# EAGLE design Yukari4 Naninator (EAGLE 7.6.0)
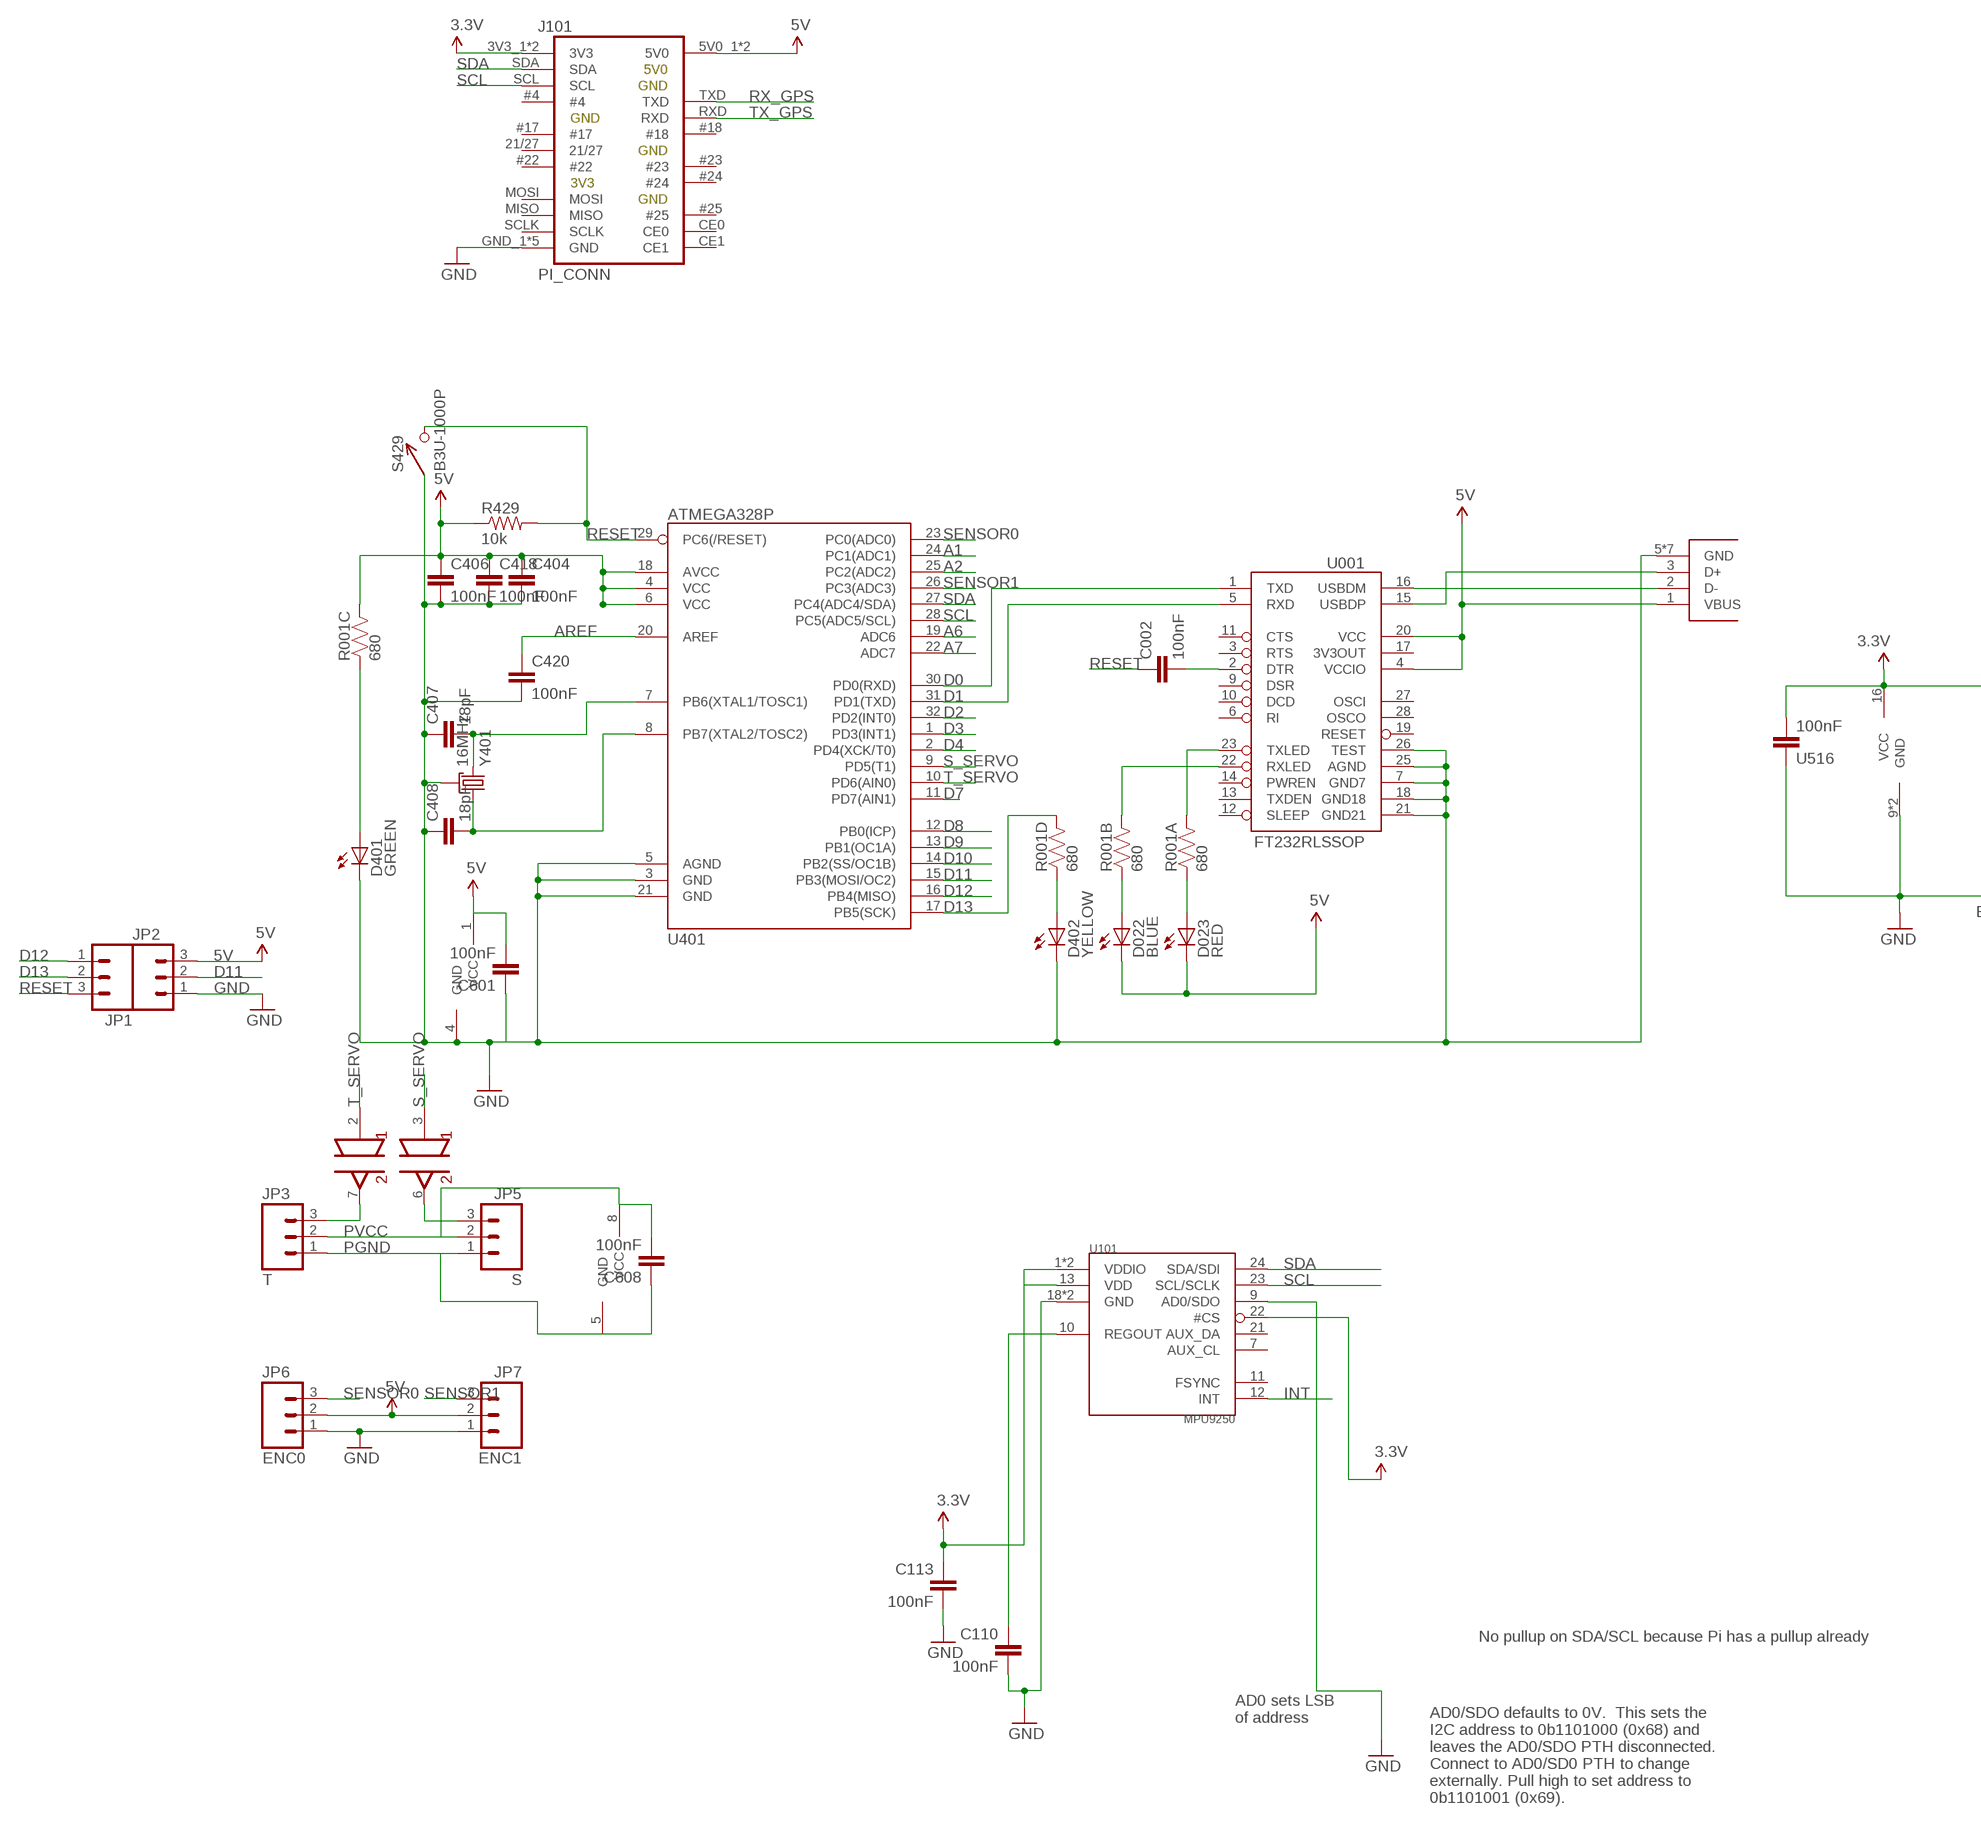
[diagram p0: schematic, sheet 1, part 1 of 2]
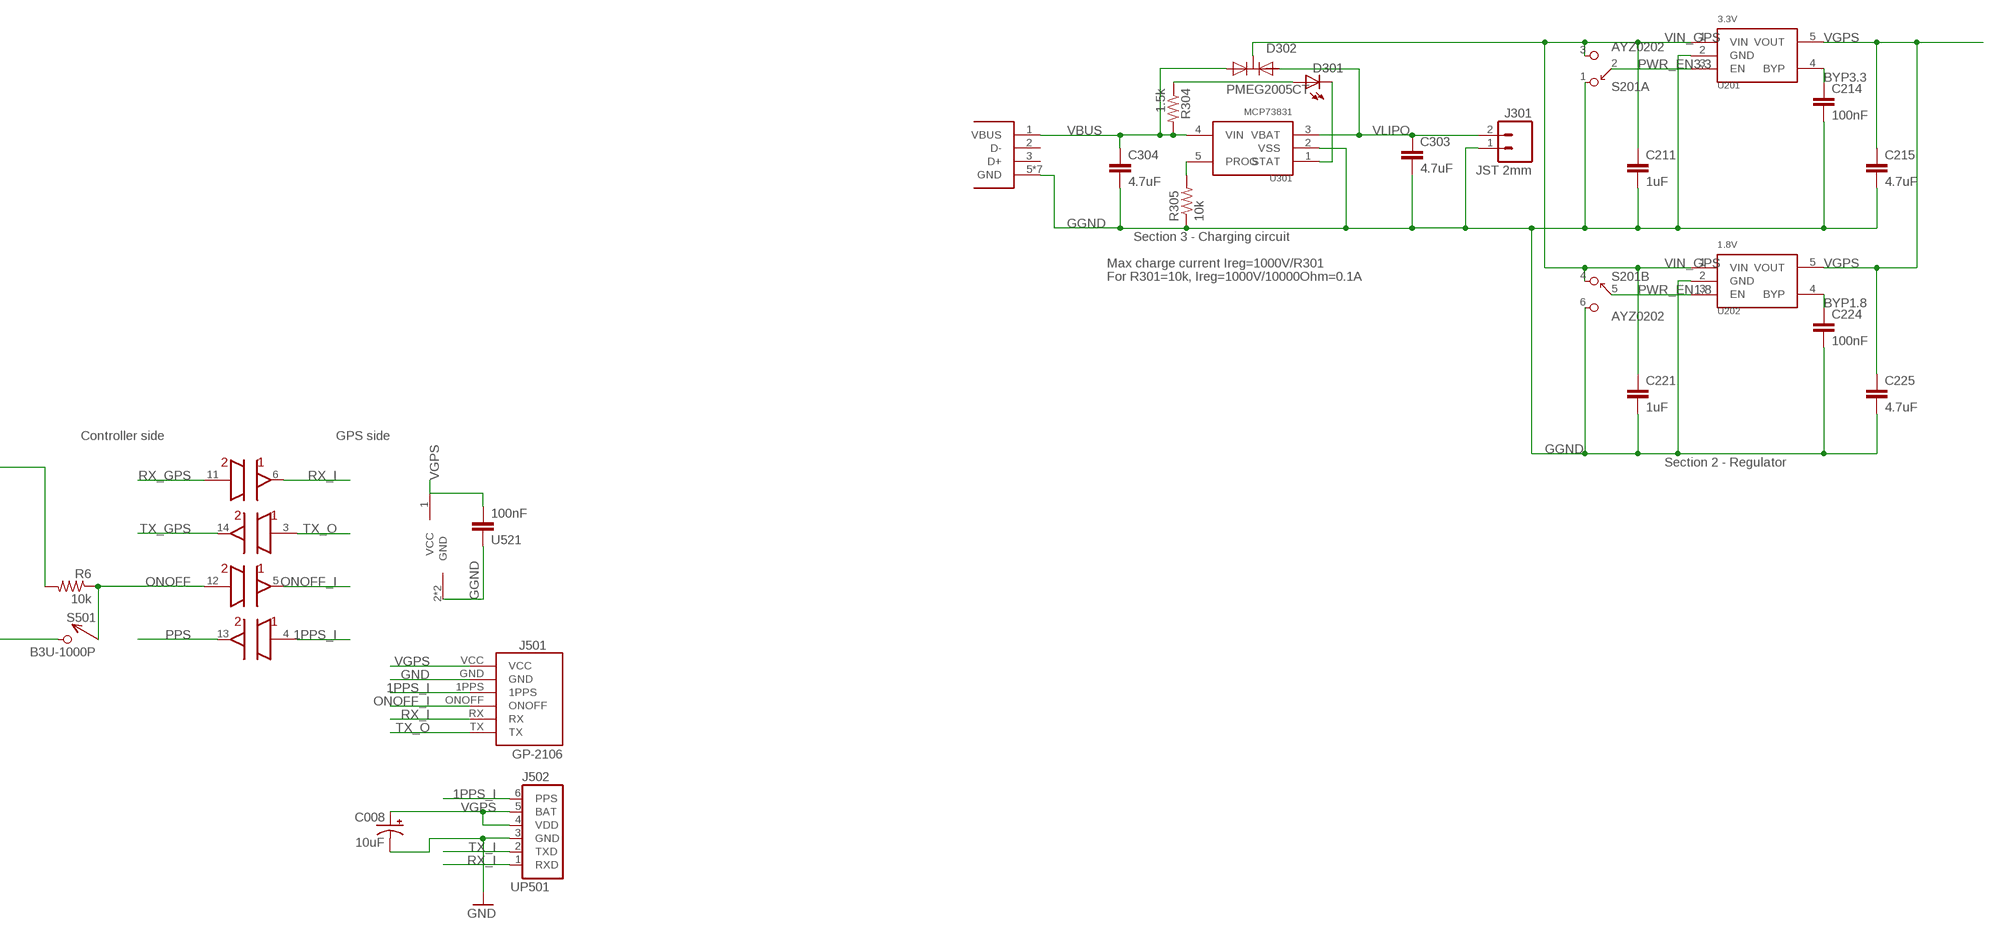
[diagram p1: schematic, sheet 1, part 2 of 2]

## Parts
C002  100nF  CAP0402-CAP  [0402-CAP]
C008  10uF  CAP_POL1206  [EIA3216]
C110  100nF  CAP0402-CAP  [0402-CAP]
C113  100nF  CAP0402-CAP  [0402-CAP]
C211  1uF  CAP0402-CAP  [0402-CAP]
C214  100nF  CAP0402-CAP  [0402-CAP]
C215  4.7uF  CAP0402-CAP  [0402-CAP]
C221  1uF  CAP0402-CAP  [0402-CAP]
C224  100nF  CAP0402-CAP  [0402-CAP]
C225  4.7uF  CAP0402-CAP  [0402-CAP]
C303  4.7uF  CAP0402-CAP  [0402-CAP]
C304  4.7uF  CAP0402-CAP  [0402-CAP]
C404  100nF  CAP0402-CAP  [0402-CAP]
C406  100nF  CAP0402-CAP  [0402-CAP]
C407  18pF  CAP0402-CAP  [0402-CAP]
C408  18pF  CAP0402-CAP  [0402-CAP]
C418  100nF  CAP0402-CAP  [0402-CAP]
C420  100nF  CAP0402-CAP  [0402-CAP]
C601  100nF  CAP0402-CAP  [0402-CAP]
C608  100nF  CAP0402-CAP  [0402-CAP]
D022  BLUE  LED0603  [LED-0603]
D023  RED  LED0603  [LED-0603]
D301  YELLOW  LED0603  [LED-0603]
D302  PMEG2005CT  DIODE_COMMON_CATHODEPMEG2005CT  [SOT-23-3]
D401  GREEN  LED0603  [LED-0603]
D402  YELLOW  LED0603  [LED-0603]
J001  USB_MICROB_JST  [UB-MC5BR3-SD204-4S]
J101  PI_CONN  [PI_CONN]
J301  JST 2mm  M02-JST-2MM-SMT  [JST-2-SMD]
J302  USB_MICROB_JST  [UB-MC5BR3-SD204-4S]
J501  GP-2106  [GP-2106]
J502  UP501  [UP501]
JP1  M03PTH  [1X03]
JP2  M03PTH  [1X03]
JP3  T  M03PTH  [1X03]
JP5  S  M03PTH  [1X03]
JP6  ENC0  M03PTH  [1X03]
JP7  ENC1  M03PTH  [1X03]
R001  680  RP404  [CRA04]
R6  10k  RESISTOR0402-RES  [0402-RES]
R304  1.5k  RESISTOR0402-RES  [0402-RES]
R305  10k  RESISTOR0402-RES  [0402-RES]
R429  10k  RESISTOR0402-RES  [0402-RES]
S201  AYZ0202  [AYZ0202]
S429  B3U-1000P  [B3U-1000P]
S501  B3U-1000P  [B3U-1000P]
U001  FT232RLSSOP  [SSOP28DB]
U101  MPU9250  [LQFN_3MM_3MM]
U201  3.3V  MIC5319D5  [SOT-23-5]
U202  1.8V  MIC5319D5  [SOT-23-5]
U301  MCP73831  [SOT-23-5]
U401  ATMEGA328P  ATMEGA168  [TQFP32-08]
U501  ADUM242E  [16-SOIC-W]
U516  100nF  CAP0402-CAP  [0402-CAP]
U521  100nF  CAP0402-CAP  [0402-CAP]
U601  ADUM3221  [SO8N]
Y401  16MHz  CX2520  [CRYSTAL_SMD_2MM_2_5MM]

## Nets
1PPS_I: J501.1PPS J502.6(PPS) U501.4(B:IN)
3.3V: C113.1 J101.3V3_1(3V3) J101.3V3_2(3V3) R6.2 U101.1(VDDIO) U101.8(VDDIO) U101.13(VDD) U101.22(#CS) U501.16(PWR2:VCC) U516.2
5V: C404.1 C406.1 C418.1 C601.2 D022.C D023.C J001.1(VBUS) J101.5V0_1(5V0) J101.5V0_2(5V0) JP2.3 JP6.2 JP7.2 R001.6 R429.1 U001.4(VCCIO) U001.20(VCC) U401.4(VCC) U401.6(VCC) U401.18(AVCC) U601.1(INP:VCC)
A1: U401.24(PC1(ADC1))
A2: U401.25(PC2(ADC2))
A6: U401.19(ADC6)
A7: U401.22(ADC7)
AREF: C420.1 U401.20(AREF)
BYP1.8: C224.1 U202.4(BYP)
BYP3.3: C214.1 U201.4(BYP)
D0: U001.1(TXD) U401.30(PD0(RXD))
D1: U001.5(RXD) U401.31(PD1(TXD))
D2: U401.32(PD2(INT0))
D3: U401.1(PD3(INT1))
D4: U401.2(PD4(XCK/T0))
D7: U401.11(PD7(AIN1))
D8: U401.12(PB0(ICP))
D9: U401.13(PB1(OC1A))
D10: U401.14(PB2(SS/OC1B))
D11: JP2.2 U401.15(PB3(MOSI/OC2))
D12: JP1.1 U401.16(PB4(MISO))
D13: JP1.2 R001.5 U401.17(PB5(SCK))
DTR#: C002.2 U001.2(DTR)
GGND: C211.2 C214.2 C215.2 C221.2 C224.2 C225.2 C303.2 C304.2 J301.1 J302.5(GND) J302.P$6(GND) J302.P$7(GND) J302.P$8(GND) J302.P$9(GND) J302.P$10(GND) J302.P$11(GND) R305.1 S201.1 S201.6 U201.2(GND) U202.2(GND) U301.2(VSS) U501.2(PWR1:GND) U501.8(PWR1:GND) U521.1
GND: C008.C(-) C110.2 C113.2 C404.2 C406.2 C407.1 C408.1 C418.2 C420.2 C601.1 D401.C D402.C J001.5(GND) J001.P$6(GND) J001.P$7(GND) J001.P$8(GND) J001.P$9(GND) J001.P$10(GND) J001.P$11(GND) J101.GND_1(GND) J101.GND_2(GND) J101.GND_3(GND) J101.GND_4(GND) J101.GND_5(GND) J501.GND J502.3(GND) JP2.1 JP6.1 JP7.1 S429.P$1 S501.P$2 U001.7(GND7) U001.18(GND18) U001.21(GND21) U001.25(AGND) U001.26(TEST) U101.9(AD0/SDO) U101.18(GND) U101.20(GND) U401.3(GND) U401.5(AGND) U401.21(GND) U501.9(PWR2:GND) U501.15(PWR2:GND) U516.1 U601.4(INP:GND) Y401.2(GND) Y401.4(GND)
INT: U101.12(INT)
N$1: C407.2 U401.7(PB6(XTAL1/TOSC1)) Y401.3
N$2: C408.2 U401.8(PB7(XTAL2/TOSC2)) Y401.1
N$3: J001.3(D+) U001.15(USBDP)
N$4: J001.2(D-) U001.16(USBDM)
N$5: D401.A R001.3
N$6: JP5.3 U601.6(B:OUT)
N$7: JP3.3 U601.7(A:OUT)
N$8: D402.A R001.4
N$9: D023.A R001.1
N$10: R305.2 U301.5(PROG)
N$11: D022.A R001.2
N$12: D301.C U301.1(STAT)
N$13: D301.A R304.1
ONOFF: R6.1 S501.P$1 U501.12(C:IN)
ONOFF_I: J501.ONOFF U501.5(C:OUT)
PGND: C608.1 JP3.1 JP5.1 U601.5(OUTP:GND)
PPS: U501.13(B:OUT)
PVCC: C608.2 JP3.2 JP5.2 U601.8(OUTP:VCC)
PWR_EN1.8: S201.5 U202.3(EN)
PWR_EN3.3: S201.2 U201.3(EN)
REGOUT: C110.1 U101.10(REGOUT)
RESET: C002.1 JP1.3 R429.2 S429.P$2 U401.29(PC6(/RESET))
RX_GPS: J101.TXD U501.11(D:IN)
RX_I: J501.RX J502.1(RXD) U501.6(D:OUT)
RXLED1: R001.7 U001.22(RXLED)
S_SERVO: U401.9(PD5(T1)) U601.3(B:IN)
SCL: J101.SCL U101.23(SCL/SCLK) U401.28(PC5(ADC5/SCL))
SDA: J101.SDA U101.24(SDA/SDI) U401.27(PC4(ADC4/SDA))
SENSOR0: JP6.3 U401.23(PC0(ADC0))
SENSOR1: JP7.3 U401.26(PC3(ADC3))
T_SERVO: U401.10(PD6(AIN0)) U601.2(A:IN)
TX_GPS: J101.RXD U501.14(A:OUT)
TX_I: J502.2(TXD)
TX_O: J501.TX U501.3(A:IN)
TXLED1: R001.8 U001.23(TXLED)
VBUS: C304.1 D302.1(A1) J302.1(VBUS) R304.2 U301.4(VIN)
VGPS [power]: C008.A(+) C215.1 C225.1 J501.VCC J502.4(VDD) J502.5(BAT) U201.5(VOUT) U202.5(VOUT) U501.1(PWR1:VCC) U521.2
VIN_GPS: C211.1 C221.1 D302.3(K) S201.3 S201.4 U201.1(VIN) U202.1(VIN)
VLIPO: C303.1 D302.2(A2) J301.2 U301.3(VBAT)
Unconnected: J101.21/27 J101.#4 J101.#17 J101.#18 J101.#22 J101.#23 J101.#24 J101.#25 J101.CE0 J101.CE1 J101.MISO J101.MOSI J101.SCLK J302.2(D-) J302.3(D+) U001.3(RTS) U001.6(RI) U001.9(DSR) U001.10(DCD) U001.11(CTS) U001.12(SLEEP) U001.13(TXDEN) U001.14(PWREN) U001.17(3V3OUT) U001.19(RESET) U001.27(OSCI) U001.28(OSCO) U101.7(AUX_CL) U101.11(FSYNC) U101.21(AUX_DA)

## Notes on the sheet
- Section 3 - Charging circuit
- Max charge current Ireg=1000V/R301
- For R301=10k, Ireg=1000V/10000Ohm=0.1A
- Controller side | GPS side
- Section 2 - Regulator
- No pullup on SDA/SCL because Pi has a pullup already
- AD0/SDO defaults to 0V.  This sets the
  I2C address to 0b1101000 (0x68) and
  leaves the AD0/SDO PTH disconnected.
  Connect to AD0/SD0 PTH to change
  externally. Pull high to set address to
  0b1101001 (0x69).
- AD0 sets LSB
  of address

## Library data of the parts
C002 C404 C406 C418 C420 C601 C608 U516 U521 = SparkFun:CAP: Capacitor Standard 0603 ceramic capacitor, and 0.1" leaded capacitor.; DIGIKEY: 445-1268-1-ND
C008 = SparkFun:CAP_POL: Capacitor Polarized These are standard SMD and PTH capacitors. Normally 10uF, 47uF, and 100uF in electrolytic and tantalum varieties. Always verify the external diameter of the through hole cap, it varies with capacity, voltage, and manufacturer. The EIA devices should be standard.
C110 C113 = SparkFun-Capacitors:CAP: Capacitor Standard 0603 ceramic capacitor, and 0.1" leaded capacitor.
C211 C221 = SparkFun:CAP: Capacitor Standard 0603 ceramic capacitor, and 0.1" leaded capacitor.; DIGIKEY: 445-4114-1-ND
C214 C224 = SparkFun:CAP: Capacitor Standard 0603 ceramic capacitor, and 0.1" leaded capacitor.; DIGIKEY: 445-1265-1-ND
C215 C225 C303 C304 = SparkFun:CAP: Capacitor Standard 0603 ceramic capacitor, and 0.1" leaded capacitor.; DIGIKEY: 445-7395-1-ND
C407 C408 = SparkFun:CAP: Capacitor Standard 0603 ceramic capacitor, and 0.1" leaded capacitor.; DIGIKEY: 445-1238-1-ND
D022 = SparkFun-LED:LED: LEDs Standard schematic elements and footprints for 5mm, 3mm, 1206, and 0603 sized LEDs. 5mm - Spark Fun Electronics SKU : COM-00529 (and others); DIGIKEY: 350-2037-1-ND
D023 = SparkFun-LED:LED: LEDs Standard schematic elements and footprints for 5mm, 3mm, 1206, and 0603 sized LEDs. 5mm - Spark Fun Electronics SKU : COM-00529 (and others); DIGIKEY: 754-1359-1-ND
D301 = SparkFun:LED: LEDs Standard schematic elements and footprints for 5mm, 3mm, 1206, and 0603 sized LEDs. 5mm - Spark Fun Electronics SKU : COM-00529 (and others); DIGIKEY: 350-2032-1-ND
D302 = KwanSystems:DIODE_COMMON_CATHODE
D401 = SparkFun-LED:LED: LEDs Standard schematic elements and footprints for 5mm, 3mm, 1206, and 0603 sized LEDs. 5mm - Spark Fun Electronics SKU : COM-00529 (and others); DIGIKEY: 350-2036-1-ND
D402 = SparkFun-LED:LED: LEDs Standard schematic elements and footprints for 5mm, 3mm, 1206, and 0603 sized LEDs. 5mm - Spark Fun Electronics SKU : COM-00529 (and others); DIGIKEY: 754-1124-1-ND
J001 J302 = KwanSystems:USB_MICROB_JST; DIGIKEY: 455-2562-1-ND
J101 = KwanSystems:PI_CONN: Raspberry Pi A/B 26-pin connector. Not valid for Pi 2/3, which have 40 pin connectors.
J301 = SparkFun:M02: Header 2 Standard 2-pin 0.1" header. Use with straight break away headers (SKU : PRT-00116), right angle break away headers (PRT-00553), swiss pins (PRT-00743), machine pins (PRT-00117), and female headers (PRT-00115). Molex polarized connector foot print use with SKU : PRT-08233 with associated crimp pins and housings.; DIGIKEY: 455-1749-1-ND
J501 = SparkFun:GP-2106: GP-2106 GPS SiRF IV
J502 = KwanSystems:UP501
JP1-JP3 JP5-JP7 = SparkFun-Connectors:M03: Header 3 Standard 3-pin 0.1" header. Use with straight break away headers (SKU : PRT-00116), right angle break away headers (PRT-00553), swiss pins (PRT-00743), machine pins (PRT-00117), and female headers (PRT-00115). Molex polarized connector foot print use with SKU : PRT-08232 with associated crimp pins and housings.; DIGIKEY: $NOPART
R001 = KwanSystems:RP4; DIGIKEY: CRA4S8680CT-ND
R6 = SparkFun:RESISTOR: Resistor Basic schematic elements and footprints for 0603, 1206, and PTH resistors.
R304 = SparkFun:RESISTOR: Resistor Basic schematic elements and footprints for 0603, 1206, and PTH resistors.; DIGIKEY: P1.50KLCT-ND
R305 = SparkFun:RESISTOR: Resistor Basic schematic elements and footprints for 0603, 1206, and PTH resistors.; DIGIKEY: P10.0KLCT-ND
R429 = SparkFun-Passives:RESISTOR: Resistor Basic schematic elements and footprints for 0603, 1206, and PTH resistors.; DIGIKEY: P10.0KLCT-ND
S201 = KwanSystems:AYZ0202: DPDT switch
S429 S501 = KwanSystems:B3U-1000P: SPST NO button
U001 = SparkFun-DigitalIC:FT232RL: USB UART FT232RL 4th Generation USB UART (USB <-> Serial) Controller. Spark Fun Electronics SKU : COM-00650; DIGIKEY: 768-1007-1-ND
U101 = KwanSystems:MPU9250
U201 U202 = KwanSystems:MIC5319; DIGIKEY: 576-1910-1-ND
U301 = KwanSystems:MCP73831; DIGIKEY: 576-1910-1-ND
U401 = SparkFun-DigitalIC:ATMEGA168: Atmel 32-pin 8-bit micro, 16k flash.; DIGIKEY: ATMEGA328P-15AZCT-ND
U501 = KwanSystems:ADUM242E: Four channel isolator, two channels in each direction Two channels from side 1 to 2, two from 2 to 1. Either side may be higher than the other. The device has an output enable, but it has an internal pullup and is left disconnected in this representation.
U601 = KwanSystems:ADUM3221: Isolated gate driver
Y401 = KwanSystems:CX2520: Crystal with grounded case; DIGIKEY: 478-6955-1-ND

## Net classes
0 default: width 0.152 mm, drill 0.33 mm, clearance 0.152 mm
1 power: width 0.152 mm, drill 0.33 mm, clearance 0.152 mm to class 0, clearance 0.152 mm

## Board
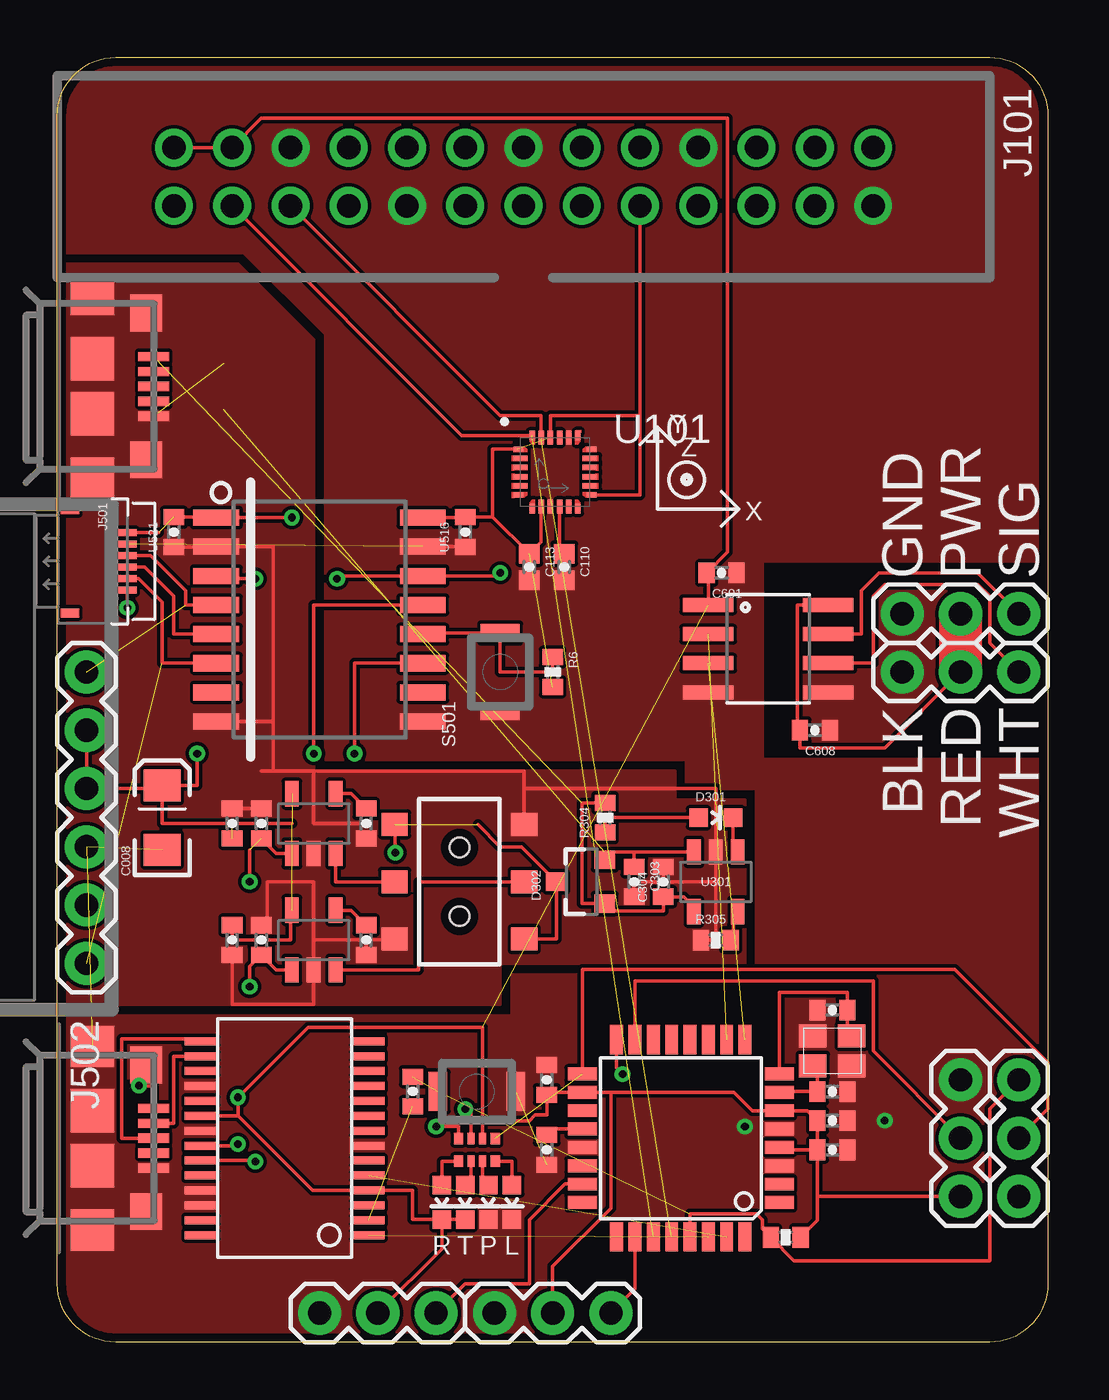
[diagram p2: board, top side]
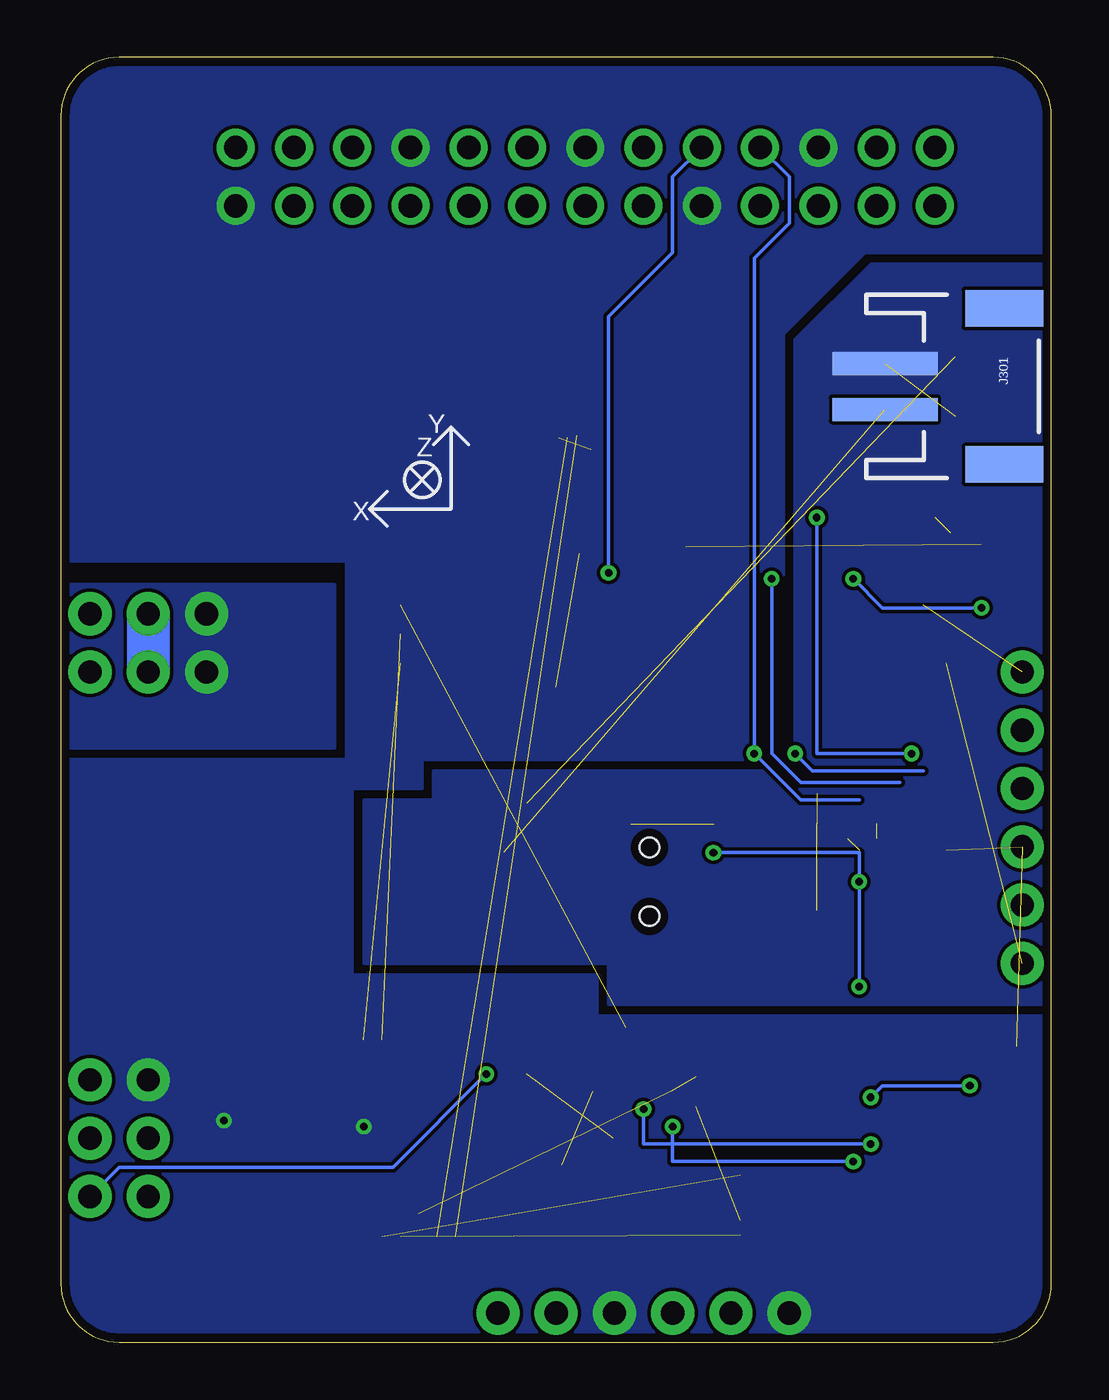
[diagram p3: board, bottom side, seen from below]

Size 43.18 x 56 mm. Coordinates in mm from the lower left corner, seen from the top.
Outline: 2.54,56 40.64,56 arc-90 43.18,53.46 43.18,2.54 arc-90 40.64,0 2.54,0 arc-90 0,2.54 0,53.46 arc-90 2.54,56
Copper layers (1*16): Top 0.0356mm / dielectric 1.5011mm / Bottom 0.0356mm
Design rules "default": minimum track width 6mil, minimum drill 13mil, track to track 6mil, track to pad 6mil, pad to pad 6mil, via to via 6mil, smd to smd 6mil, copper to edge 15mil, drill to drill 6mil, minimum pad ring 7mil, minimum via ring 7mil, stop-mask expansion 4mil, vias tented up to drill 14mil, thermal gap 10mil

### Footprints (pad centres in the part's own frame; a part is rotated, then mirrored left to right if it is on the bottom)
0402-CAP = smd 0.7 x 0.9: 1 -0.65,0; 2 0.65,0
EIA3216 = smd 1.4 x 1.6: A 1.4,0; C -1.4,0
0402-CAP' = smd 0.85 x 0.9: 1 -0.58,0; 2 0.58,0
LED-0603 = smd 0.8 x 0.8: A 0,-0.75; C 0,0.75
SOT-23-3 = smd 0.9 x 0.8: 1 -1,0.95; 2 -1,-0.95; 3 1.1,0
UB-MC5BR3-SD204-4S = smd 0.4 x 1.35: 1 -1.3,2.675; 2 -0.65,2.675; 3 0,2.675; 4 0.65,2.675; 5 1.3,2.675 | smd 1.8 x 1.9: P$6 4,0; P$7 -4,0 | smd 1.9 x 1.9: P$8 -1.2,0; P$9 1.2,0 | smd 1.6 x 1.4: P$10 -3.2,2.35; P$11 3.2,2.35
PI_CONN = drill 1.016 pad 1.651: 3V3_1 15.24,1.27; 3V3_2 -5.08,1.27; 5V0_1 12.7,-1.27; 5V0_2 15.24,-1.27; 21/27 0,1.27; #4 7.62,1.27; #17 2.54,1.27; #18 2.54,-1.27; #22 -2.54,1.27; #23 -2.54,-1.27; #24 -5.08,-1.27; #25 -10.16,-1.27; CE0 -12.7,-1.27; CE1 -15.24,-1.27; GND_1 5.08,1.27; GND_2 -15.24,1.27; GND_3 -7.62,-1.27; GND_4 0,-1.27; GND_5 10.16,-1.27; MISO -10.16,1.27; MOSI -7.62,1.27; RXD 5.08,-1.27; SCL 10.16,1.27; SCLK -12.7,1.27; SDA 12.7,1.27; TXD 7.62,-1.27
JST-2-SMD = smd 1 x 4.6: 1 -1,-3.7; 2 1,-3.7 | smd 1.6 x 3.4: NC1 -3.4,1.5; NC2 3.4,1.5
GP-2106 = smd 0.3 x 0.8: 1PPS -0.25,0; GND -0.75,0; ONOFF 0.25,0; RX 0.75,0; TX 1.25,0; VCC -1.25,0 | smd 0.4 x 0.8: P$7 -2.25,-2.5; P$8 2.25,-2.5
UP501 = drill 1.016 pad 1.88: 1 0,0; 2 2.54,0; 3 5.08,0; 4 7.62,0; 5 10.16,0; 6 12.7,0
1X03 = drill 1.016 pad 1.88: 1 0,0; 2 2.54,0; 3 5.08,0
CRA04 = smd 0.4 x 0.5: 1 -0.8,-0.5; 4 0.8,-0.5; 5 0.8,0.5; 8 -0.8,0.5 | smd 0.3 x 0.5: 2 -0.25,-0.5; 3 0.25,-0.5; 6 0.25,0.5; 7 -0.25,0.5
0402-RES = smd 0.7 x 0.9: 1 -0.65,0; 2 0.65,0
AYZ0202 = smd 1 x 1.15: 1 -2.5,2.825; 2 0,2.825; 3 2.5,2.825; 4 -2.5,-2.825; 5 0,-2.825; 6 2.5,-2.825 | hole 0.85: 1.5,0; -1.5,0
B3U-1000P = smd 0.8 x 1.7: P$1 -1.7,0; P$2 1.7,0
SSOP28DB = smd 0.348 x 1.397: 1 -4.225,-3.656; 2 -3.575,-3.656; 3 -2.925,-3.656; 4 -2.275,-3.656; 5 -1.625,-3.656; 6 -0.975,-3.656; 7 -0.325,-3.656; 8 0.325,-3.656; 9 0.975,-3.656; 10 1.625,-3.656; 11 2.275,-3.656; 12 2.925,-3.656; 13 3.575,-3.656; 14 4.225,-3.656; 15 4.225,3.656; 16 3.575,3.656; 17 2.925,3.656; 18 2.275,3.656; 19 1.625,3.656; 20 0.975,3.656; 21 0.325,3.656; 22 -0.325,3.656; 23 -0.975,3.656; 24 -1.625,3.656; 25 -2.275,3.656; 26 -2.925,3.656; 27 -3.575,3.656; 28 -4.225,3.656
LQFN_3MM_3MM = smd 0.4 x 0.24: 1 -1.6,1; 6 -1.6,-1; 13 1.6,-1; 18 1.6,1 | smd 0.6 x 0.24: 2 -1.5,0.6; 3 -1.5,0.2; 4 -1.5,-0.2; 5 -1.5,-0.6; 14 1.5,-0.6; 15 1.5,-0.2; 16 1.5,0.2; 17 1.5,0.6 | smd 0.24 x 0.4: 7 -1,-1.6; 12 1,-1.6; 19 1,1.6; 24 -1,1.6 | smd 0.24 x 0.6: 8 -0.6,-1.5; 9 -0.2,-1.5; 10 0.2,-1.5; 11 0.6,-1.5; 20 0.6,1.5; 21 0.2,1.5; 22 -0.2,1.5; 23 -0.6,1.5
SOT-23-5 = smd 0.6 x 1.1: 1 -0.95,-1.3; 2 0,-1.3; 3 0.95,-1.3; 4 0.95,1.3; 5 -0.95,1.3
TQFP32-08 = smd 1.27 x 0.559: 1 -4.293,2.8; 2 -4.293,2; 3 -4.293,1.2; 4 -4.293,0.4; 5 -4.293,-0.4; 6 -4.293,-1.2; 7 -4.293,-2; 8 -4.293,-2.8; 17 4.293,-2.8; 18 4.293,-2; 19 4.293,-1.2; 20 4.293,-0.4; 21 4.293,0.4; 22 4.293,1.2; 23 4.293,2; 24 4.293,2.8 | smd 0.559 x 1.27: 9 -2.8,-4.293; 10 -2,-4.293; 11 -1.2,-4.293; 12 -0.4,-4.293; 13 0.4,-4.293; 14 1.2,-4.293; 15 2,-4.293; 16 2.8,-4.293; 25 2.8,4.293; 26 2,4.293; 27 1.2,4.293; 28 0.4,4.293; 29 -0.4,4.293; 30 -1.2,4.293; 31 -2,4.293; 32 -2.8,4.293
16-SOIC-W = smd 0.7 x 2: 1 -4.445,-4.5; 2 -3.175,-4.5; 3 -1.905,-4.5; 4 -0.635,-4.5; 5 0.635,-4.5; 6 1.905,-4.5; 7 3.175,-4.5; 8 4.445,-4.5; 9 4.445,4.5; 10 3.175,4.5; 11 1.905,4.5; 12 0.635,4.5; 13 -0.635,4.5; 14 -1.905,4.5; 15 -3.175,4.5; 16 -4.445,4.5
SO8N = smd 0.61 x 2.21: 1 -1.905,-2.616; 2 -0.635,-2.616; 3 0.635,-2.616; 4 1.905,-2.616; 5 1.905,2.616; 6 0.635,2.616; 7 -0.635,2.616; 8 -1.905,2.616
CRYSTAL_SMD_2MM_2_5MM = smd 1.2 x 1: 1 -0.85,-0.65; 2 0.85,-0.65; 3 0.85,0.65; 4 -0.85,0.65

### Placement (x,y rotation side)
C002  15.49,10.92 270 top
C008  4.57,22.86 90 top
C110  100nF  [0402-CAP']  22.1,33.78 270 top
C113  100nF  [0402-CAP']  20.57,33.78 270 top
C211  8.89,17.53 90 top
C214  13.46,17.53 270 top
C215  7.62,17.53 270 top
C221  8.89,22.61 90 top
C224  13.46,22.61 270 top
C225  7.62,22.61 90 top
C303  25.15,20.07 270 top
C304  26.42,20.07 90 top
C404  33.78,8.38 0 top
C406  33.78,9.65 0 top
C407  33.78,10.92 180 top
C408  33.78,14.48 0 top
C418  21.34,11.43 90 top
C420  21.34,8.38 270 top
C601  28.96,33.53 180 top
C608  33.02,26.67 180 top
D022  17.78,6.1 180 top
D023  16.76,6.1 180 top
D301  28.7,22.86 270 top
D302  22.86,20.07 180 top
D401  18.8,6.1 180 top
D402  19.81,6.1 180 top
J001  1.52,8.89 270 top
J101  20.32,50.8 180 top
J301  3.56,41.66 270 bottom
J302  1.52,41.66 270 top
J501  3.05,34.04 270 top
J502  1.27,16.51 90 top
JP1  41.91,6.35 90 top
JP2  39.37,11.43 270 top
JP3  36.83,31.75 0 top
JP5  36.83,29.21 0 top
JP6  11.43,1.27 0 top
JP7  19.05,1.27 0 top
R001  18.29,8.38 0 top
R6  21.59,29.21 270 top
R304  23.88,22.86 90 top
R305  28.7,17.53 0 top
R429  31.75,4.57 180 top
S201  17.53,20.07 270 top
S429  18.29,10.92 180 top
S501  19.3,29.21 270 top
U001  9.91,8.89 90 top
U101  21.69,37.92 0 top
U201  11.18,17.53 0 top
U202  11.18,22.61 0 top
U301  28.7,20.07 180 top
U401  27.18,8.89 180 top
U501  11.43,31.5 270 top
U516  17.78,35.31 90 top
U521  5.08,35.31 90 top
U601  30.99,30.23 270 top
U$2  [AXES]  26.16,36.32 0 top
Y401  33.78,12.7 180 top

### Tracks (layer width: path | path; a pad name or v marks a point on that pad's centre or on a via)
1PPS_I  (1 unrouted)
  Top 0.152: U501.4 5.59,32.13 5.59,32.77 4.07,34.29 J501.1PPS
3.3V  (3 unrouted)
  Top 0.152: U501.16 17.77,35.94 U516.2 18.98,35.96 | 18.98,35.96 C113.1 21.09,34.88 U101.8 | 25.4,40.39 25.4,36.92 U101.13 23.11,36.92 | 25.4,40.39 J101.3V3_2 | 20.07,38.92 20.07,38.86 | 18.98,35.96 18.98,38.92 U101.1 | U101.22 21.49,40.39 25.4,40.39
5V  (via drill 0.33)  (1 unrouted)
  Top 0.152: 7.87,9.87 v7.87,10.67 10.92,13.72 18.54,13.72 18.54,9.65 | 7.87,9.87 U001.20 | D023.C D022.C | JP7.2 21.59,3.3 24.13,5.84 24.13,10.89 | 24.13,10.89 U401.18 21.34,10.89 C418.1 21.34,9.91 20.83,9.91 20.57,9.65 18.54,9.65 | U401.4 31.58,8.38 C404.1 | C404.1 C406.1 32.69,10.09 U401.6 30.3,10.09 29.5,10.89 24.13,10.89 | C404.1 33.13,6.35 | 33.13,6.35 33.13,5.3 R429.1 | U601.1 28.37,33.46 C601.2 29.21,34.43 29.21,53.34 8.89,53.34 J101.5V0_1 J101.5V0_2 | JP2.3 33.13,6.35 | JP6.2 16.76,4.06 D023.C | D023.C 15.49,5.35 15.49,6.62 U001.4 11.12,6.62 7.87,9.87 | J001.1 4.2,11.18 v3.56,11.18 | R001.6 18.54,9.65
  Bottom 0.152: v3.56,11.18 7.37,11.18 v7.87,10.67
AREF
  Top 0.152: C420.1 21.34,9.29 U401.20
BYP1.8
  Top 0.152: C224.1 12.81,23.91 U202.4
BYP3.3
  Top 0.152: U201.4 12.81,18.83 C214.1
D0  (1 unrouted)
D1  (1 unrouted)
D11
  Top 0.152: U401.15 25.18,15.75 35.56,15.75 35.56,12.7 JP2.2
D12  (via drill 0.33)
  Top 0.152: U401.16 24.38,11.94 v24.64,11.68
  Bottom 0.152: v24.64,11.68 28.7,7.62 40.64,7.62 JP1.1
D13  (1 unrouted)
  Top 0.152: U401.17 22.89,16.26 39.12,16.26 43.18,12.19 43.18,10.16 JP1.2
DTR#  (1 unrouted)
GGND  (1 unrouted)
  Top 0.152: U521.1 6.92,34.66 U501.2 9.4,34.67 9.4,27.05 | 9.4,27.05 U501.8 | 11.18,17.53 U201.2 11.18,14.73 7.62,14.73 C215.2 | 11.18,17.53 13.46,17.53 | 13.46,17.53 C214.2 | 13.46,22.61 11.18,22.61 11.18,24.89 | 11.18,17.53 11.18,20.07 9.14,20.07 9.14,18.43 C211.2 | 11.18,24.89 9.4,24.89 | 13.46,17.53 14.7,17.53 | C303.2 25.15,20.07 26.42,20.07 | 26.42,20.07 C304.2 | 28.7,20.07 U301.2 28.7,24.13 20.35,24.13 | 28.7,20.07 26.42,20.07 | 20.35,22.61 S201.1 20.35,24.13 | R305.1 28.7,17.53 28.7,20.07 | 11.18,24.89 20.35,24.89 20.35,24.13 | 9.4,27.05 9.4,24.89 | 9.4,24.89 8.89,24.89 | C221.2 C225.2
  pour Bottom (no thermals): 0,46.99 7.87,46.99 11.18,43.69 11.18,24.89 26.92,24.89 26.92,23.62 29.97,23.62 29.97,16.51 19.3,16.51 19.3,14.73 0,14.73
  pour Top (no thermals): 0,46.99 7.87,46.99 11.18,43.69 11.18,24.89 26.92,24.89 26.92,23.62 29.97,23.62 29.97,16.51 19.3,16.51 19.3,14.73 0,14.73
GND  (via drill 0.33)  (4 unrouted)
  Top 0.152: U516.1 17.77,34.67 U501.15 | C110.2 21.84,33.02
  other vias: 36.07,9.65 29.97,9.4
  pour Top (no thermals): 2.54,55.98 41.81,55.98 arc-90 43.18,53.44 43.18,34.04 30.73,34.04 30.73,25.4 43.18,25.4 43.18,2.54 arc-90 41.81,0 2.54,0 arc-90 0,2.54 0,14.22 19.81,14.22 19.81,16 30.48,16 30.48,24.13 27.43,24.13 27.43,25.4 11.68,25.4 11.68,43.94 8.13,47.5 0,47.5 0,53.44 arc-90
  pour Bottom (no thermals): 2.54,55.98 41.81,55.98 arc-90 43.18,53.44 43.18,34.04 30.73,34.04 30.73,25.4 43.18,25.4 43.18,2.54 arc-90 41.81,0 2.54,0 arc-90 0,2.54 0,14.22 19.81,14.22 19.81,16 30.48,16 30.48,24.13 27.43,24.13 27.43,25.4 11.68,25.4 11.68,43.94 8.13,47.5 0,47.5 0,53.44 arc-90
N$1
  Top 0.152: U401.7 31.47,10.92 C407.2 33.13,12.05 Y401.3
N$2
  Top 0.152: Y401.1 34.43,13.55 C408.2 34.43,15.24 31.47,15.24 U401.8
N$3
  Top 0.152: J001.3 2.79,8.89 2.79,13.21 6.25,13.21 U001.15
N$4
  Top 0.152: J001.2 5.08,9.54 5.08,12.45 6.25,12.45 U001.16
N$5
  Top 0.152: R001.3 18.54,7.1 D401.A
N$6
  Top 0.152: U601.6 35.56,29.59 35.56,32.51 36.07,33.02 40.13,33.02 40.64,32.51 40.64,30.48 JP5.3
N$7
  Top 0.152: 33.15,30.86 U601.7 35.05,30.86 35.05,32.77 35.81,33.53 40.13,33.53 JP3.3
N$8
  Top 0.152: R001.4 19.81,7.88 D402.A
N$9
  Top 0.152: R001.1 16.76,7.88 D023.A
N$10
  Top 0.152: R305.2 29.46,17.53 29.46,18.29 29.65,18.29 U301.5
N$11
  Top 0.152: R001.2 18.04,7.1 D022.A
N$12
  Top 0.152: U301.1 29.45,21.37 D301.C
N$13
  Top 0.152: D301.A 23.88,22.86 R304.1
ONOFF
  Top 0.152: U501.12 15.93,30.91 S501.P$1 19.3,29.21 21.59,29.21 R6.1
ONOFF_I
  Top 0.152: U501.5 5.08,30.86 5.08,32.51 3.81,33.79 J501.ONOFF
PGND
  pour Top (no thermals): 31.24,33.02 43.18,33.02 43.18,25.91 31.24,25.91
  pour Bottom (no thermals): 31.24,33.02 43.18,33.02 43.18,25.91 31.24,25.91
PPS  (via drill 0.33)
  Top 0.152: v11.18,25.65 11.18,32.13 U501.13
  Bottom 0.152: 5.59,24.89 10.41,24.89 v11.18,25.65
PVCC
  Top 0.152: U601.8 32.26,32.13 32.26,26.78 arc90 C608.2 32.37,25.91 36.07,25.91 JP5.2
  Top 1.88: JP3.2 JP5.2
  Bottom 1.88: JP3.2 JP5.2
PWR_EN1.8
  Top 0.152: S201.5 12.13,20.07 U202.3
PWR_EN3.3
  Top 0.152: U201.3 15.75,16.23 15.75,20.07 S201.2
REGOUT
  Top 0.152: U101.10 21.89,34.41 C110.1
RESET  (2 unrouted)
  Top 0.152: U401.29 27.58,5.59 30.48,5.59 30.73,5.33 30.73,4.94 R429.2 32.12,3.56 40.64,3.56 40.64,10.16 JP1.3
RX_GPS  (via drill 0.33)
  Top 0.152: v12.95,25.65 12.95,29.59 U501.11
  Bottom 0.152: 8.38,23.62 10.92,23.62 v12.95,25.65 12.95,47.24 11.43,48.77 11.43,50.8 J101.TXD
RX_I  (1 unrouted)
  Top 0.152: U501.6 4.57,29.59 4.57,32.26 3.56,33.27 3.05,33.27 J501.RX
RXLED1  (via drill 0.33)
  Top 0.152: U001.22 7.87,8.56 v7.87,8.64 | v17.78,10.16 18.04,10.16 R001.7
  Bottom 0.152: v7.87,8.64 17.78,8.64 v17.78,10.16
S_SERVO  (1 unrouted)
SCL  (1 unrouted)
  Top 0.152: J101.SCL 19.3,40.39 21.09,40.39 U101.23
SDA  (1 unrouted)
  Top 0.152: J101.SDA 17.63,39.52 U101.24
SENSOR0
  Top 0.152: U401.23 22.13,6.89 20.57,5.33 20.57,2.54 17.78,2.54 JP6.3
SENSOR1
  Top 0.152: JP7.3 25.18,2.32 U401.26
T_SERVO  (1 unrouted)
TX_GPS  (via drill 0.33)
  Top 0.152: v12.19,33.27 12.32,33.4 U501.14 19.18,33.4 v19.3,33.53
  Bottom 0.152: 6.6,24.38 10.92,24.38 12.19,25.65 v12.19,33.27 | J101.RXD 16.51,50.8 16.51,47.5 19.3,44.7 v19.3,33.53
TX_O  (via drill 0.33)
  Top 0.152: U501.3 6.93,33.27 v8.64,33.27 | v3.05,32 J501.TX
  Bottom 0.152: v8.64,33.27 7.37,32 v3.05,32
TXLED1  (via drill 0.33)
  Top 0.152: U001.23 8.64,7.92 v8.64,7.87 | v16.51,9.4 17.49,9.4 R001.8
  Bottom 0.152: v8.64,7.87 16.51,7.87 v16.51,9.4
VBUS  (1 unrouted)
  Top 0.152: D302.1 24.16,19.42 | U301.4 27.69,18.83 27.69,19.05 27.32,19.42 C304.1 26.42,18.8 24.18,18.8 arc-90 D302.1 | R304.2 22.86,23.51 22.86,19.12 D302.1
VGPS  (via drill 0.33)  (4 unrouted)
  Top 0.152: U521.2 6.92,35.96 U501.1 v10.23,35.94 | U201.5 10.16,18.76 10.16,17.53 7.62,17.53 C215.1 | 10.23,22.61 7.62,22.61 4.57,22.61 C008.A | C008.A 4.57,24.13 J502.4 J502.5 | v6.1,25.65 6.1,24.26 C008.A | 4.41,35.29 J501.VCC
  Bottom 0.152: v10.23,35.94 10.23,25.65 v6.1,25.65
VIN_GPS  (via drill 0.33)  (3 unrouted)
  Top 0.152: U201.1 9.54,16.23 C211.1 8.38,16.37 v8.38,15.49 | 14.73,22.57 v14.73,21.34 | v8.38,20.07 8.38,21.45 | S201.3 21.76,17.57 D302.3 20.24,21.59 19.3,21.59 18.33,22.57 | C221.1 9.54,21.31 U202.1
  Bottom 0.152: v14.73,21.34 8.38,21.34 v8.38,20.07 v8.38,15.49
VLIPO  (1 unrouted)
  Top 0.152: U301.3 25.15,21.37 | 25.15,21.37 23.86,21.37 D302.2 | C303.1 25.15,21.37
(copper drawn outside any net)
  shapes: Top area x10

### Text on the board
tPlace: GND | PWR | SIG | BLK | RED | WHT | R | T | P | L